# Altium project AutoLidar_VIP_Spring25.PrjPcb (part 2 of 2)
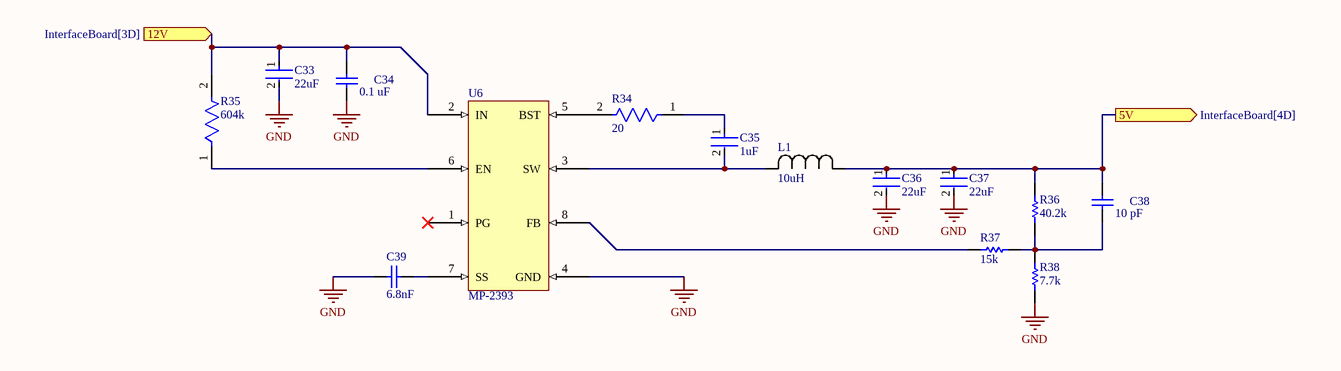
[diagram p9: 5V Regulator.SchDoc]

## Nets that join several sheets
5V: Root (J1.4), BNO055 (U8.1), MSub (U?.HV), USB HUB (7 pins)
5V_ESC: Root (J2A.A2 J2B.A2 J2C.A2), Manual Override (IC2.16 R31.1 U9.8), 5ch Receiver (U10.P)
12V: Root (J1.7 JTRIAL.1), 5V Regulator (C33.1 C34.2 R35.2 U6.2)
GND: Root (9 pins), InterfaceBoard (12 pins), Manual Override (6 pins), BNO055 (U8.3), 5ch Receiver (U10.G), L Subsys1 (UL.GND1 UL.GND2 UL.GND3), MSub (5 pins), USB HUB (44 pins), 5V Regulator (7 pins)
DN1.D+: L Subsys1 (UL.D+), USB HUB (IC1.2)
DN1.D-: L Subsys1 (UL.D-), USB HUB (IC1.1)
DN1.VBUS: Root (J1.11), L Subsys1 (UL.VIN), USB HUB (C27.2 R26.1 U2.8)
DN2.D+: MSub (UM.D+), USB HUB (IC1.4)
DN2.D-: MSub (UM.D-), USB HUB (IC1.3)
DN2.VBUS: Root (J2C.A3), MSub (U?.HV3 UM.VIN), USB HUB (C24.2 R23.1 U2.5)
DN3.D-: InterfaceBoard (J6.2), USB HUB (IC1.55 IC1.56)
DN3.VBUS: InterfaceBoard (J6.1), USB HUB (C26.2 R25.1 U4.5)
DN4.D+: InterfaceBoard (J10.3), USB HUB (IC1.54)
DN4.D-: InterfaceBoard (J10.2), USB HUB (IC1.53)
DN4.VBUS: InterfaceBoard (J10.1), USB HUB (C29.2 R28.1 U4.8)
DN5.D+: InterfaceBoard (J7.3), USB HUB (IC1.7)
DN5.D-: InterfaceBoard (J7.2), USB HUB (IC1.6)
DN5.VBUS: InterfaceBoard (J7.1), USB HUB (C28.2 R27.1 U3.8)
DN6.D+: InterfaceBoard (J11.3), USB HUB (IC1.9)
DN6.D-: InterfaceBoard (J11.2), USB HUB (IC1.8)
DN6.VBUS: InterfaceBoard (J11.1), USB HUB (C25.2 R24.1 U3.5)
IM1A.SIG: Manual Override (IC2.2), 5ch Receiver (U10.1)
IM1B.SIG: Manual Override (IC2.3), MSub (U?.HV2)
IM1Y.SIG: Root (J2B.A3), Manual Override (IC2.4)
IM2A.SIG: Manual Override (IC2.5), 5ch Receiver (U10.2)
IM2B.SIG: Manual Override (IC2.6), MSub (U?.HV1)
IM2Y.SIG: Root (J2A.A3), Manual Override (IC2.7)
IM3A.SIG: Manual Override (R33.1), 5ch Receiver (U10.3)
NetU8_6: BNO055 (U8.6), MSub (UM.22-A8/CTX1)
NetU8_8: BNO055 (U8.8), MSub (UM.23-A9/CRX1/CCLK1)
SCL: BNO055 (U8.5), MSub (UM.19-A5/SCL0)
SDA: BNO055 (U8.4), MSub (UM.18-A4/SDA0)
UP.D+: Root (J4.3), USB HUB (IC1.59)
UP.D-: Root (J4.2), USB HUB (IC1.58)
UP.VBUS: Root (J4.1), USB HUB (C6.2 R15.1)
WIL2.RX: Root (J1.2), L Subsys1 (UL.0-RX1)
WIL3: Root (J1.5), L Subsys1 (UL.8-TX2/IN1)
WIL5.SIG: Root (J1.14), L Subsys1 (UL.2-OUT2)
WIL6.CHA: Root (J1.10), L Subsys1 (UL.15-A1/RX3/S-PDIF_IN)
WIL6.CHB: Root (J1.12), L Subsys1 (UL.14-A0/TX3/S-PFI_OUT)
WIL6.IDX: Root (J1.9), L Subsys1 (UL.20-A6/TX5/LRCLK1)